# Altium project project_x.PrjPcb
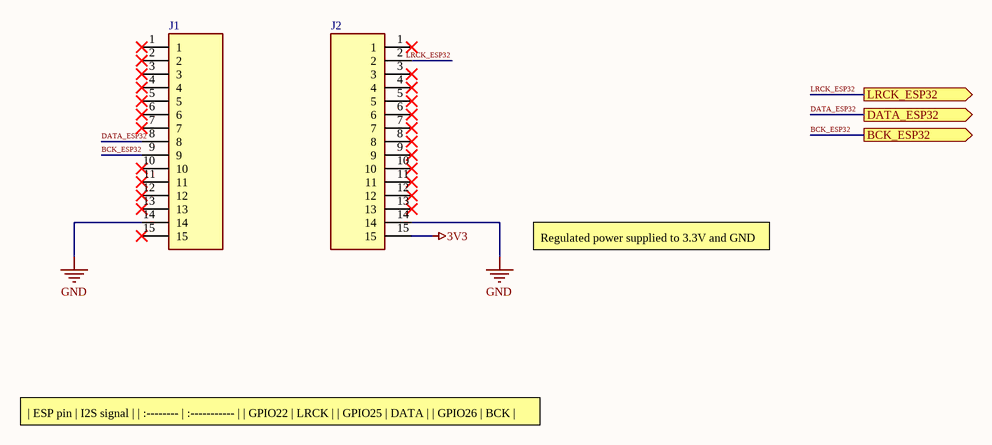
[diagram p0: esp32.SchDoc]
1 sheet, 2 parts. Net scope: flat (ports and power ports of the same name join across sheets).

## Sheet esp32.SchDoc
size A4

### Parts
J1  PPPC151LFBN-RC  [RHDR15W80P0X254_1X15_3860X254X870P]  (value not drawn)
J2  PPPC151LFBN-RC  [RHDR15W80P0X254_1X15_3860X254X870P]  (value not drawn)

### Ports
BCK_ESP32 (out), DATA_ESP32 (out), LRCK_ESP32 (out)

### Nets
3V3: J2.15
GND: J1.14 J2.14
BCK_ESP32: J1.9 ; port BCK_ESP32
DATA_ESP32: J1.8 ; port DATA_ESP32
LRCK_ESP32: J2.2 ; port LRCK_ESP32

Not connected (* = marked no-connect by the designer): J1 1* 2* 3* 4* 5* 6* 7* 10* 11* 12* 13* 15*; J2 1* 3* 4* 5* 6* 7* 8* 9* 10* 11* 12* 13*

### Notes on the sheet
- Regulated power supplied to 3.3V and GND pins.
- | ESP pin | I2S signal | | :-------- | :----------- | | GPIO22 | LRCK | | GPIO25 | DATA | | GPIO26 | BCK |

### Library data of the parts
J1 J2 = PPPC151LFBN-RC: CONN HEADER FMALE 15POS .1" GOLD; Manufacturer: Sullins; Number of Positions: 15; Pitch: 0.1inch; Supplier 1: Digi-Key; Manufacturer Part Number: PPPC151LFBN-RC; RoHS: Yes; Category: Connectors; Stock 1: 7808; Pricing 1: 1=1.02000, 10=0.89300, 80=0.77025, 440=0.63018, 1000=0.56016, 5000=0.49014, 10000=0.46680 (USD); Mount: Through Hole; Color: Black; Contact Plating: Gold; Contact Material: Bronze; Housing Material: Plastic; Package Quantity: 1000; Number of Rows: 1; Packaging: Bulk; Termination: Solder; Connector Type: Header; Contact Type: Female Socket; Length: 38.6mm; Width: 2.5mm; Height: 8.5mm; Lead Free: Lead Free; RoHS Compliant: Yes; ComponentLink1URL: https://media.digikey.com/pdf/Data%20Sheets/Sullins%20PDFs/Female_Headers.100_DS.pdf?src-supplier=Digi-Key; ComponentLink1Description: https://media.digikey.com/pdf/Data%20Sheets/Sullins%20PDFs/Female_Headers.100_DS.pdf?src-supplier=Digi-Key; Supplier Part Number 1: S7048-ND